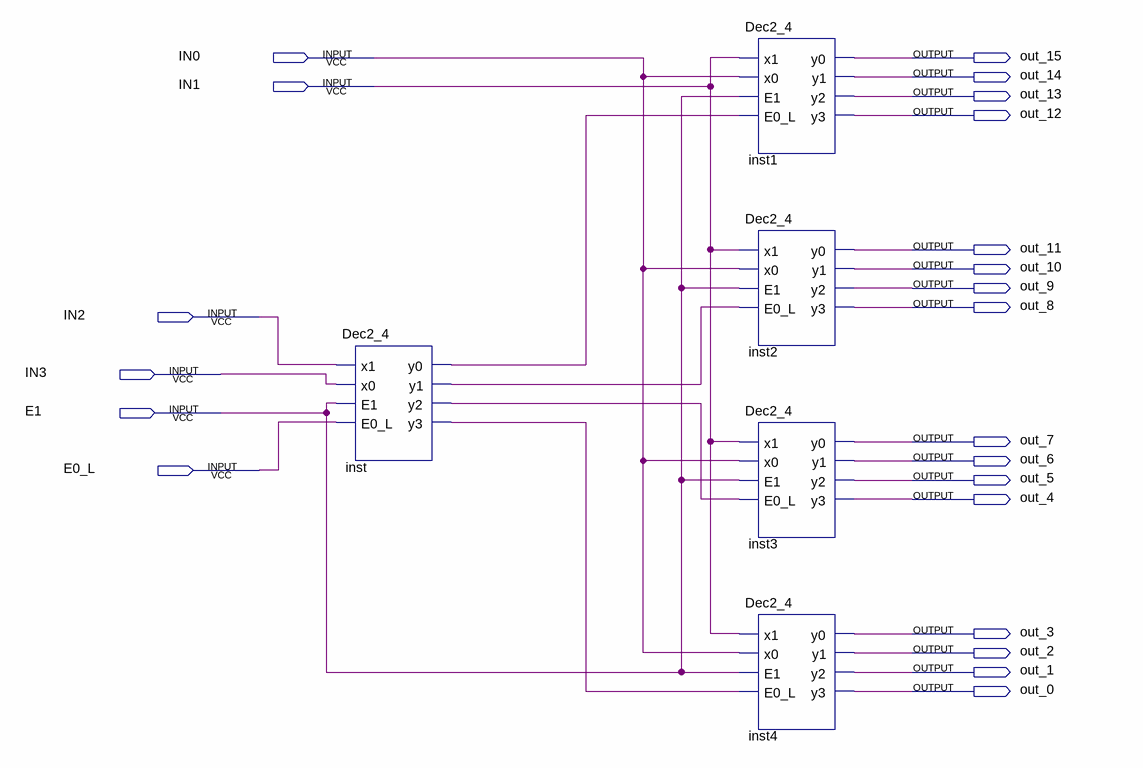
[diagram p0: schematic sheet]
// Quartus schematic Dec4_16.bdf as structural Verilog: 5 symbols, 22 pins
module Dec4_16 (
  input  IN0,
  input  IN1,
  input  IN2,
  input  IN3,
  input  E1,
  input  E0_L,
  output out_15,
  output out_14,
  output out_13,
  output out_12,
  output out_11,
  output out_10,
  output out_9,
  output out_8,
  output out_7,
  output out_6,
  output out_5,
  output out_4,
  output out_3,
  output out_2,
  output out_1,
  output out_0
);

  wire inst_y0, inst_y1, inst_y2, inst_y3;

  Dec2_4 inst (.x1(IN2), .x0(IN3), .E1(E1), .E0_L(E0_L), .y0(inst_y0), .y1(inst_y1), .y2(inst_y2), .y3(inst_y3));
  Dec2_4 inst1 (.x1(IN1), .x0(IN0), .E1(E1), .E0_L(inst_y0), .y0(out_15), .y1(out_14), .y2(out_13), .y3(out_12));
  Dec2_4 inst2 (.x1(IN1), .x0(IN0), .E1(E1), .E0_L(inst_y1), .y0(out_11), .y1(out_10), .y2(out_9), .y3(out_8));
  Dec2_4 inst3 (.x1(IN1), .x0(IN0), .E1(E1), .E0_L(inst_y2), .y0(out_7), .y1(out_6), .y2(out_5), .y3(out_4));
  Dec2_4 inst4 (.x1(IN1), .x0(IN0), .E1(E1), .E0_L(inst_y3), .y0(out_3), .y1(out_2), .y2(out_1), .y3(out_0));
endmodule
